# Altium project master_code.PrjPcb
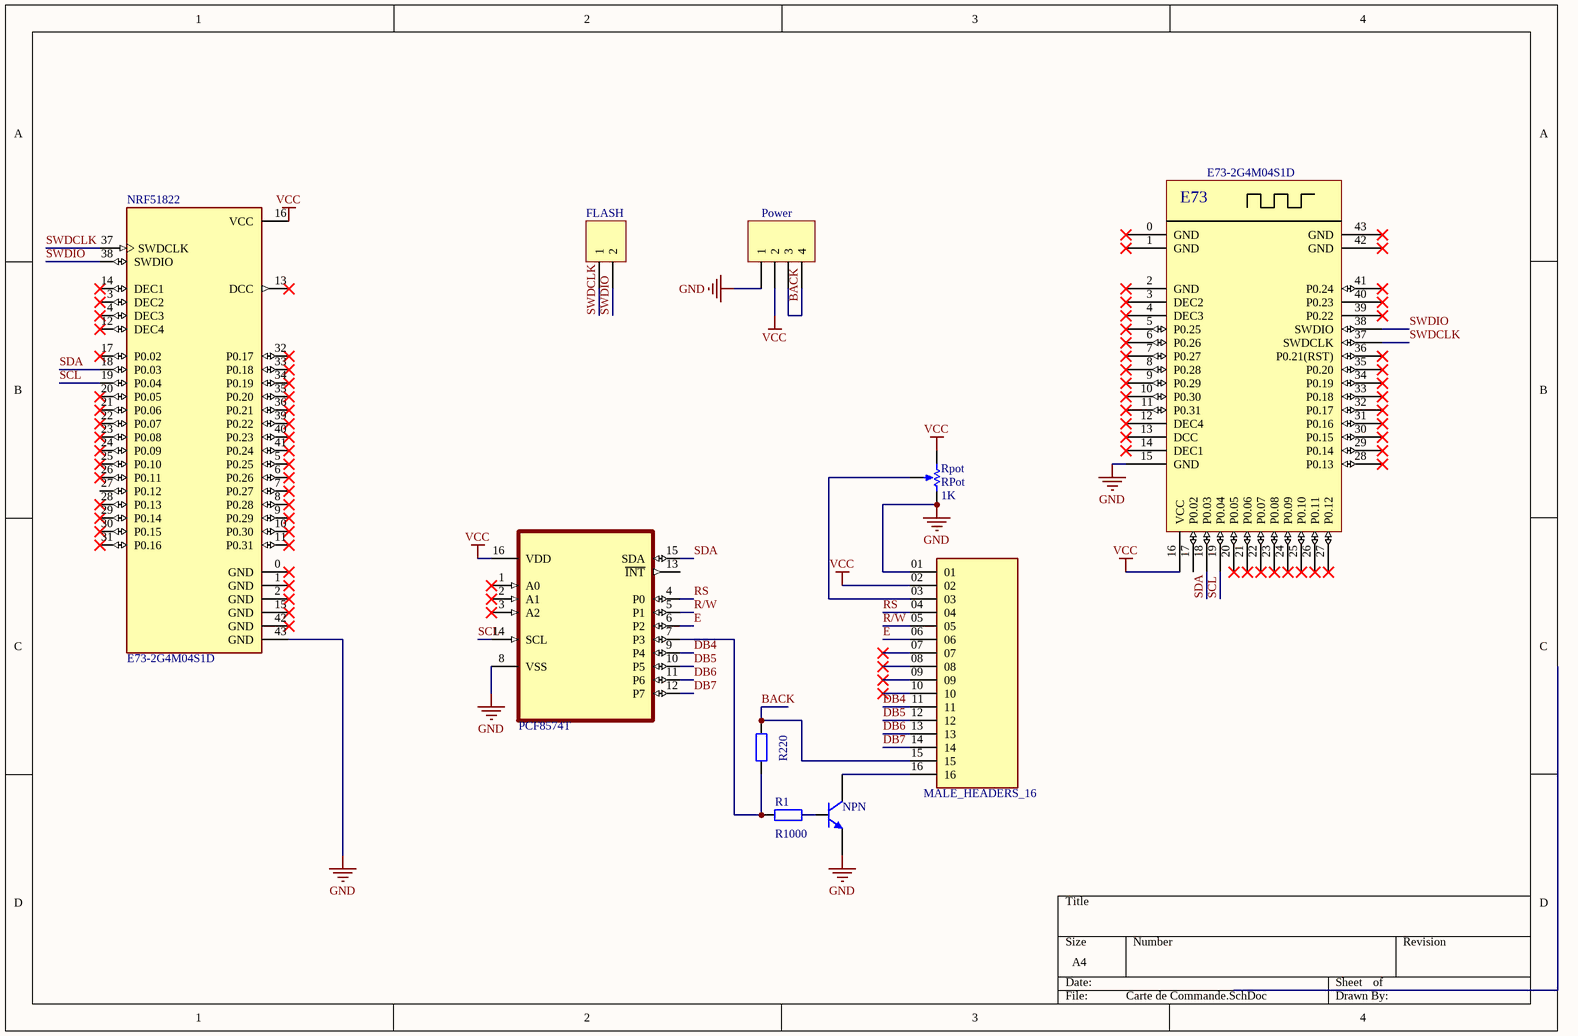
[diagram p0: Carte de Commande.SchDoc]
1 sheet, 10 parts. Net scope: global (net labels, ports and power ports of the same name join across sheets).
Board file: Carte de Commande.PcbDoc

## Sheet Carte de Commande.SchDoc
size A4

### Parts
?  E73-2G4M04S1D  [E73-2G4M04S1D]
FLASH  Header 2H  [HDR1X2H]  (value not drawn)
M_H_16  MALE_HEADERS_16  [male_headers_16]
NPN  NPN  [TO-226-AA]  (value not drawn)
NRF51822  E73-2G4M04S1D  [XCVR_E73-2G4M04S1B]
PCF  PCF8574T  [SOIC127P1032X265-16N]
Power  header 4H  [HDR1X4H]  (value not drawn)
R1  value R1000  [AXIAL-0.4]
R2  value R220  [AXIAL-0.4]
Rpot  RPot  value 1K  [VR5]

### Nets
GND: ?.15(GND) M_H_16.01 NPN.3(E) NRF51822.43(GND) PCF.8(VSS) Power.1 Rpot.2(BOT)
VCC: ?.16(VCC) M_H_16.02 NRF51822.16(VCC) PCF.16(VDD) Power.2 Rpot.1(TOP)
BACK: M_H_16.15 Power.3 Power.4 R2.2
DB4: M_H_16.11 PCF.9(P4)
DB5: M_H_16.12 PCF.10(P5)
DB6: M_H_16.13 PCF.11(P6)
DB7: M_H_16.14 PCF.12(P7)
E: M_H_16.06 PCF.6(P2)
R/W: M_H_16.05 PCF.5(P1)
RS: M_H_16.04 PCF.4(P0)
SCL: ?.19(P0.04) NRF51822.19(P0.04) PCF.14(SCL)
SDA: ?.18(P0.03) NRF51822.18(P0.03) PCF.15(SDA)
SWDCLK: ?.37(SWDCLK) FLASH.1 NRF51822.37(SWDCLK)
SWDIO: ?.38(SWDIO) FLASH.2 NRF51822.38(SWDIO)
NetM_H_16_03: M_H_16.03 Rpot.3(TAP)
NetM_H_16_16: M_H_16.16 NPN.1(C)
NetNPN_2: NPN.2(B) R1.2
NetPCF_7: PCF.7(P3) R1.1 R2.1

Not connected (* = marked no-connect by the designer): ? 0(GND)* 1(GND)* 2(GND)* 3(DEC2)* 4(DEC3)* 5(P0.25)* 6(P0.26)* 7(P0.27)* 8(P0.28)* 9(P0.29)* 10(P0.30)* 11(P0.31)* 12(DEC4)* 13(DCC)* 14(DEC1)* 17(P0.02) 20(P0.05)* 21(P0.06)* 22(P0.07)* 23(P0.08)* 24(P0.09)* 25(P0.10)* 26(P0.11)* 27(P0.12)* 28(P0.13)* 29(P0.14)* 30(P0.15)* 31(P0.16)* 32(P0.17)* 33(P0.18)* 34(P0.19)* 35(P0.20)* 36(P0.21(RST))* 39(P0.22)* 40(P0.23)* 41(P0.24)* 42(GND)* 43(GND)*; M_H_16 07* 08* 09* 10*; NRF51822 0(GND)* 1(GND)* 2(GND)* 3(DEC2)* 4(DEC3)* 5(P0.25)* 6(P0.26)* 7(P0.27)* 8(P0.28)* 9(P0.29)* 10(P0.30)* 11(P0.31)* 12(DEC4)* 13(DCC)* 14(DEC1)* 15(GND)* 17(P0.02)* 20(P0.05)* 21(P0.06)* 22(P0.07)* 23(P0.08)* 24(P0.09)* 25(P0.10)* 26(P0.11)* 27(P0.12) 28(P0.13)* 29(P0.14)* 30(P0.15)* 31(P0.16)* 32(P0.17)* 33(P0.18)* 34(P0.19)* 35(P0.20)* 36(P0.21)* 39(P0.22)* 40(P0.23)* 41(P0.24)* 42(GND)*; PCF 1(A0)* 2(A1)* 3(A2)* 13(~{INT})

### Notes on the sheet
- (in symbol nrf51822) E73

### Library data of the parts
? = nrf51822: E73-2G4M04S1D is a small Bluetooth module that features ultra low power consumption with dual antenna PCB and IPX antenna of high performance. Based on originally imported IC nRF51822 from NORDIC,the module supports BLE 4.2 protocol.
FLASH = Header 2H: Header, 2-Pin, Right Angle; LatestRevisionDate: 17-Jul-2002; LatestRevisionNote: Re-released for DXP Platform.; Publisher: Altium Limited
M_H_16 = MALE_HEADERS_16: MP: TSW-116-23-S-S-LL; Package: None; Price: None; Value: *; Availability: Unavailable
NPN = NPN: NPN Bipolar Transistor; Published: 8-Jun-2000; LatestRevisionDate: 17-Jul-2002; LatestRevisionNote: Re-released for DXP Platform.; PackageReference: TO-226-AA; Publisher: Altium Limited; PackageDescription: TO, Flat Index; 3 In-Line, Axial Leads; Body Dia. 4.8mm; Leads 0.55 x 0.51 mm (max); Code_JEDEC: TO-226-AA
NRF51822 = E73-2G4M04S1B: nRF52832 BLE 4.2/5.0 SMD Wireless Module; MF: EBYTE; Availability: Unavailable; Price: None; Package: Package; MP: E73-2G4M04S1B; Value: *; SnapEDA_Link: https://www.snapeda.com/parts/E73-2G4M04S1B/EBYTE/view-part/4219264/?ref=snap
PCF = PCF8574T: I/O Expander 8 IÂ²C 100 kHz 20-SSOP; MF: NXP Semiconductors; MP: PCF8574T; Price: None; Availability: In Stock; Package: SOIC-16 NXP Semiconductors; Purchase-URL: https://pricing.snapeda.com/search/part/PCF8574T/?ref=eda; SnapEDA_Link: https://www.snapeda.com/parts/PCF8574T/NXP+Semiconductors/view-part/?ref=snap; Value: *; Check_prices: https://www.snapeda.com/parts/PCF8574T/NXP+Semiconductors/view-part/?ref=eda
Power = Header 4H: Header, 4-Pin, Right Angle; LatestRevisionDate: 17-Jul-2002; LatestRevisionNote: Re-released for DXP Platform.; Publisher: Altium Limited
R1 R2 = Res2: Resistor; Published: 8-Jun-2000; LatestRevisionDate: 17-Jul-2002; LatestRevisionNote: Re-released for DXP Platform.; PackageReference: AXIAL-0.4; Publisher: Altium Limited; PackageDescription: Axial Device, Thru-Hole; 2 Leads; 0.4 in Pin Spacing
Rpot = RPot: Potentiometer; Sim Note: Enter the Resistance value and the set point into parameter fields.; Set Position: 0.5; Published: 8-Jun-2000; LatestRevisionDate: 17-Jul-2002; LatestRevisionNote: Re-released for DXP Platform.; PackageReference: VR5; Publisher: Altium Limited; PackageDescription: Variable Resistor, Thru-Hole; 3 Leads